# EAGLE design TalonPortBreakout (EAGLE 9.6.2)
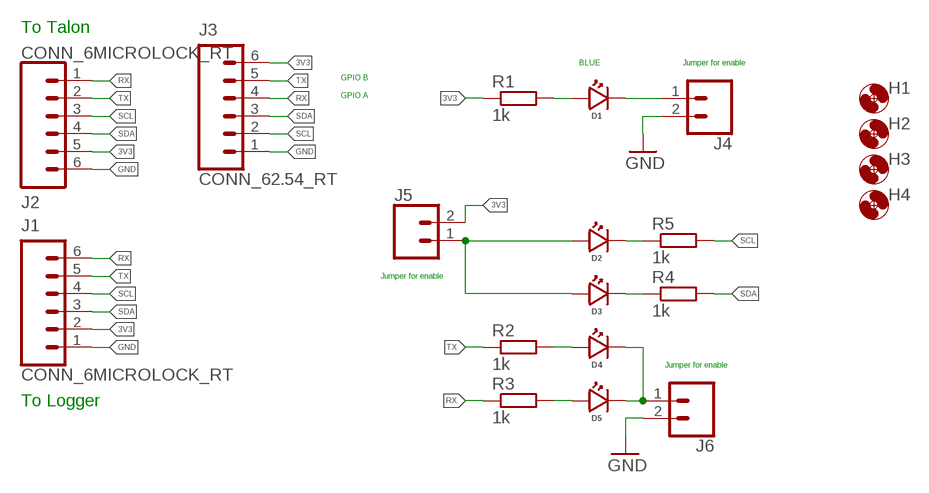
[diagram p0: schematic, sheet 1]

## Parts
D1  LEDBLUE0603  [LED_0603]
D2  LEDAMBER0603  [LED_0603]
D3  LEDAMBER0603  [LED_0603]
D4  LEDGREEN0603  [LED_0603]
D5  LEDRED0603  [LED_0603]
H1  MOUNTING_HOLE2_NP  [2_56]
H2  MOUNTING_HOLE2_NP  [2_56]
H3  MOUNTING_HOLE2_NP  [2_56]
H4  MOUNTING_HOLE2_NP  [2_56]
J1  CONN_6MICROLOCK_RT  [1X06_MICROLOCKPLUS_RT]
J2  CONN_6MICROLOCK_RT  [1X06_MICROLOCKPLUS_RT]
J3  CONN_62.54_RT  [1X06/90]
J4  CONN_02  [1X02]
J5  CONN_02  [1X02]
J6  CONN_02  [1X02]
R1  1k  R-EU_1KR0402  [R0402]
R2  1k  R-EU_1KR0402  [R0402]
R3  1k  R-EU_1KR0402  [R0402]
R4  1k  R-EU_1KR0402  [R0402]
R5  1k  R-EU_1KR0402  [R0402]

## Nets
3V3: J1.2 J2.5 J3.6 J5.2 R1.1
GND: J1.1 J2.6 J3.1 J4.2 J6.2
N$1: D1.ANODE R1.2
N$2: D1.CATHODE J4.1
N$3: D4.ANODE R2.2
N$4: D5.ANODE R3.2
N$5: D3.CATHODE R4.1
N$6: D2.CATHODE R5.1
N$7: D4.CATHODE D5.CATHODE J6.1
N$8: D2.ANODE D3.ANODE J5.1
RX: J1.6 J2.1 J3.4 R3.1
SCL: J1.4 J2.3 J3.2 R5.2
SDA: J1.3 J2.4 J3.3 R4.2
TX: J1.5 J2.2 J3.5 R2.1

## Notes on the sheet
- To Talon
- BLUE | Jumper for enable
- GPIO B
- GPIO A
- Jumper for enable
- Jumper for enable
- To Logger

## Library data of the parts
D1 = bschulz:LED: Genaric LED; DIGIKEY: 732-4966-1-ND; MF: Wurth; MPN: 150060BS75000
D2 D3 = bschulz:LED: Genaric LED; DIGIKEY: 732-150060AS75000CT-ND; MF: Wurth; MPN: 150060AS75000
D4 = bschulz:LED: Genaric LED; DIGIKEY: 732-4971-1-ND; MF: Wurth; MPN: 150060GS75000
D5 = bschulz:LED: Genaric LED; DIGIKEY: 732-4978-1-ND; MF: Wurth; MPN: 150060RS75000
H1-H4 = bschulz:MOUNTING_HOLE: Genaric Mechanical Mounting Hole Hole diameter based on max body diameter + 15% Keepout ring is for diameter of socket cap screw (minimum required clearance) TPlace ring is for diameter of pan head screw (recomended clearance) Specifications: Socket Cap <http://fastener-express.com/fastener-technical/SocketscapSS-Alloy.pdf> Button Head Socket Cap <http://fastener-express.com/fastener-technical/Button-Socket-alloy.pdf> Pan Head <http://fastener-express.com/fastener-technical/pan-machine-Screws.pdf>; DIGIKEY: DNP; MF: N/A; MPN: DNP
J1 J2 = bschulz:CONN_6: Genaric 6 terminal header Digikey 2.54_SCREW <https://www.digikey.com/product-detail/en/on-shore-technology-inc/OSTVN06A150/ED10565-ND/1588866>; DIGIKEY: WM22471CT-ND; MF: Molex; MPN: 5055670681
J3 = bschulz:CONN_6: Genaric 6 terminal header Digikey 2.54_SCREW <https://www.digikey.com/product-detail/en/on-shore-technology-inc/OSTVN06A150/ED10565-ND/1588866>
J4-J6 = bschulz:CONN_02: Genaric 2 terminal header SCREW_2.54 <https://www.digikey.com/product-detail/en/on-shore-technology-inc/OSTVN02A150/ED10561-ND/1588862> 39532_RA <https://www.digikey.com/product-detail/en/molex/0395321002/WM7845-ND/1280696>
R1-R5 = bschulz_passives:R-EU_: RESISTOR, European symbol Digikey Parts: Yageo, 0402 <https://www.digikey.com/products/en/resistors/chip-resistor-surface-mount/52?k=&pkeyword=&sv=0&s=4356&sf=1&FV=-1%7C13%2C7%7C2%2C1291%7C39157%2C1989%7C0%2C-8%7C52%2C3%7C1131%2C3%7C2503&quantity=&ColumnSort=0&page=1&stock=1&pageSize=25> Yageo, 0603 <https://www.digikey.com/products/en/resistors/chip-resistor-surface-mount/52?k=&pkeyword=&sv=0&pv1291=39245&sf=1&FV=-5%7C4356%2C-5%7C47360%2C-8%7C52%2C-1%7C13%2C7%7C2%2C1989%7C0&quantity=10&ColumnSort=1000011&page=1&stock=1&pageSize=25> Panasonic, 0603 <https://www.digikey.com/products/en/resistors/chip-resistor-surface-mount/52?k=&pkeyword=&pv252=68&sf=0&FV=ffec373d%2C1c0002%2C142c040c%2C1f140000%2Cffe00034%2C80002%2Cc0001&quantity=&ColumnSort=0&page=1&stock=1&pageSize=25> Panasonic, precision, 0603 <https://www.digikey.com/products/en/resistors/chip-resistor-surface-mount/52?FV=ffec4907%2Cfffc000a%2Cc0172%2C142c040c%2C1f140000%2Cffe00034%2C1c0002&quantity=100&ColumnSort=2085&page=1&stock=1&pageSize=25> Panasonic, 0805 <https://www.digikey.com/products/en/resistors/chip-resistor-surface-mount/52?k=&pkeyword=&pv3=1&sf=0&FV=ffec373d%2C1c0002%2C1f140000%2Cffe00034%2C142c040d&quantity=&ColumnSort=0&page=1&stock=1&pageSize=25> Rohm, current sense <https://www.digikey.com/products/en/resistors/chip-resistor-surface-mount/52?k=&pkeyword=&pv3=1&sf=0&FV=ffecb688%2C1f140000%2Cffe00034%2C1c0002&quantity=&ColumnSort=0&page=1&stock=1&pageSize=25> Vishay, pulse proof automotive <https://www.digikey.com/products/en/resistors/chip-resistor-surface-mount/52?k=&pkeyword=&pv7=2&sf=0&FV=ffec5d6b%2Cffe00034%2C1f140000&quantity=&ColumnSort=0&page=1&stock=1&pageSize=25>; DIGIKEY: 311-1.00KLRCT-ND; MF: Yageo; MPN: RC0402FR-071KL; VALUE_PART: 1k

## Board
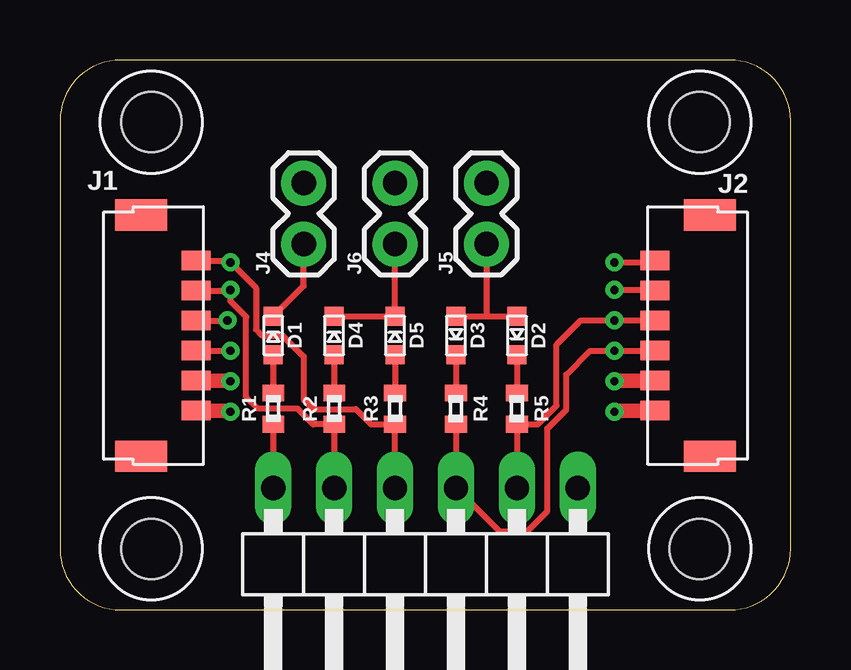
[diagram p1: board, top side]
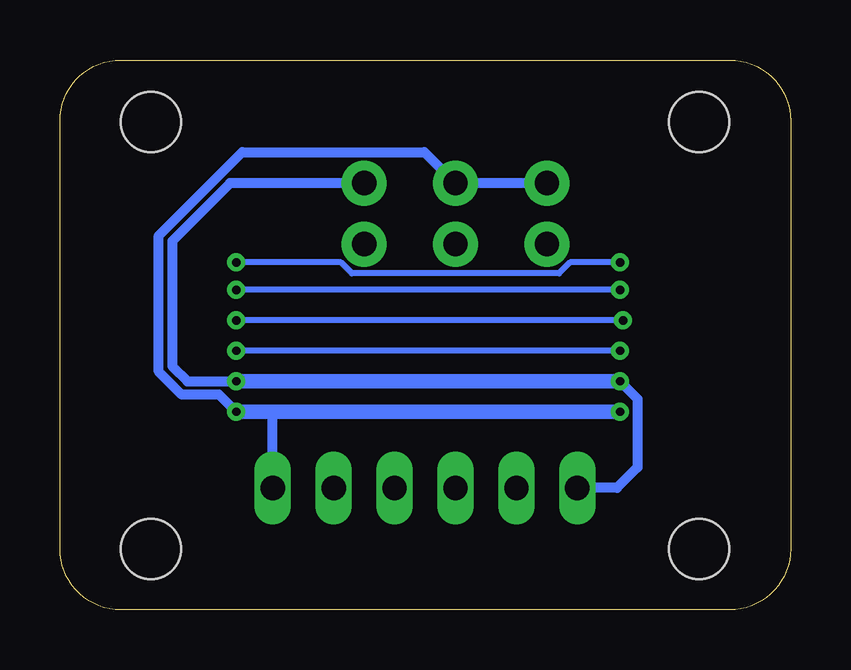
[diagram p2: board, bottom side, seen from below]

Size 30.46 x 22.91 mm. Coordinates in mm from the lower left corner, seen from the top.
Outline: 27.92,22.91 2.54,22.91 arc90 0,20.37 0,2.54 arc90 2.54,0 27.92,0 arc90 30.46,2.54 30.46,20.37 arc90 27.92,22.91
Copper layers (1*16): Top 0.035mm / dielectric 1.5mm / Bottom 0.035mm
Design rules "default": minimum track width 6mil, minimum drill 0.35mm, track to track 6mil, track to pad 6mil, pad to pad 6mil, via to via 6mil, smd to smd 6mil, copper to edge 40mil, drill to drill 6mil, minimum pad ring 10mil, minimum via ring 8mil, stop-mask expansion 4mil, vias tented up to drill 0mil, thermal gap 10mil

### Footprints (pad centres in the part's own frame; a part is rotated, then mirrored left to right if it is on the bottom)
LED_0603 = smd 0.8 x 0.8: ANODE 0.8,0; CATHODE -0.8,0
2_56 = hole 2.5: 0,0
1X06_MICROLOCKPLUS_RT = smd 0.8 x 1.2: 1 -3.125,-0.6; 2 -1.875,-0.6; 3 -0.625,-0.6; 4 0.625,-0.6; 5 1.875,-0.6; 6 3.125,-0.6 | smd 1.3 x 2.15: BODY@1 -5.025,1.695; BODY@2 5.025,1.695
1X06/90 = drill 1.016 long: 1 -6.35,-3.81; 2 -3.81,-3.81; 3 -1.27,-3.81; 4 1.27,-3.81; 5 3.81,-3.81; 6 6.35,-3.81
1X02 = drill 1.016 pad 1.88: 1 0,0; 2 2.54,0
R0402 = smd 0.7 x 0.9: 1 -0.65,0; 2 0.65,0

### Placement (x,y rotation side)
D1  8.89,11.43 270 top
D2  19.05,11.43 90 top
D3  16.51,11.43 90 top
D4  11.43,11.43 270 top
D5  13.97,11.43 270 top
H1  3.81,2.54 0 top
H2  26.67,2.54 0 top
H3  3.81,20.32 0 top
H4  26.67,20.32 0 top
J1  5.08,11.43 90 top
J2  25.4,11.43 270 top
J3  15.24,1.27 180 top
J4  10.16,15.24 90 top
J5  17.78,15.24 90 top
J6  13.97,15.24 90 top
R1  8.89,8.38 90 top
R2  11.43,8.38 90 top
R3  13.97,8.38 90 top
R4  16.51,8.38 270 top
R5  19.05,8.38 270 top

### Tracks (layer width: path | path; a pad name or v marks a point on that pad's centre or on a via)
3V3  (via drill 0.35)
  Top 0.254: R1.1 J3.6
  Top 0.61: J1.2 7.08,9.55 v7.11,9.53 | v23.11,9.53 23.14,9.55 J2.5
  Bottom 0.406: J5.2 23.37,17.78 25.78,15.37 25.78,10.16 25.15,9.53 v23.11,9.53 | v7.11,9.53 6.38,8.79 6.38,5.94 7.24,5.08 J3.6
  Bottom 0.61: v7.11,9.53 v23.11,9.53
GND  (via drill 0.35)
  Top 0.61: J1.1 7.06,8.3 v7.11,8.26 | v23.11,8.26 23.16,8.3 J2.6
  Bottom 0.406: J4.2 J6.2 15.27,19.07 22.86,19.07 26.34,15.6 26.34,9.93 25.38,8.97 23.82,8.97 v23.11,8.26 | J3.1 21.59,8.26
  Bottom 0.61: v7.11,8.26 21.59,8.26 v23.11,8.26
N$1
  Top 0.254: D1.ANODE R1.2
N$2
  Top 0.254: D1.CATHODE 10.16,13.5 J4.1
N$3
  Top 0.254: D4.ANODE R2.2
N$4
  Top 0.254: D5.ANODE R3.2
N$5
  Top 0.254: D3.CATHODE R4.1
N$6
  Top 0.254: D2.CATHODE R5.1
N$7
  Top 0.254: D4.CATHODE D5.CATHODE J6.1
N$8
  Top 0.254: D3.ANODE 17.78,12.23 | 17.78,12.23 D2.ANODE | J5.1 17.78,12.23
RX  (via drill 0.35)
  Top 0.254: J1.6 7.04,14.55 v7.11,14.48 8.18,13.41 8.18,11.68 8.43,11.43 9.29,11.43 10.16,10.55 10.16,8.76 10.56,8.36 12.34,8.36 12.97,7.73 R3.1 J3.4 | v23.11,14.48 24.72,14.48 J2.1
  Bottom 0.254: v7.11,14.48 9.2,14.48 9.65,14.02 18.29,14.02 18.74,14.48 v23.11,14.48
SCL  (via drill 0.35)
  Top 0.254: J1.4 6.97,12.05 v6.99,12.06 | J2.3 24.79,12.06 v23.11,12.06 21.72,12.06 20.7,11.05 20.7,8.51 19.92,7.73 R5.2 J3.2
  Bottom 0.254: v6.99,12.06 v23.11,12.06
SDA  (via drill 0.35)
  Top 0.254: J1.3 7.1,10.8 v7.11,10.79 | J2.4 23.12,10.8 v23.11,10.79 22.1,10.79 21.11,9.8 21.11,8.34 20.32,7.55 20.32,4.12 19.48,3.28 18.31,3.28 J3.3 R4.2
  Bottom 0.254: v7.11,10.79 v23.11,10.79
TX  (via drill 0.35)
  Top 0.254: J1.5 7.08,13.3 v7.11,13.34 7.11,12.87 7.77,12.21 7.77,8.87 8.26,8.38 9.91,8.38 10.56,7.73 R2.1 J3.5 | v23.11,13.34 24.77,13.34 J2.2
  Bottom 0.254: v7.11,13.34 v23.11,13.34

### Text on the board
tDocu: PWR | TX | RX | SDA | SCL | Logger | Talon | 3v3 | GND